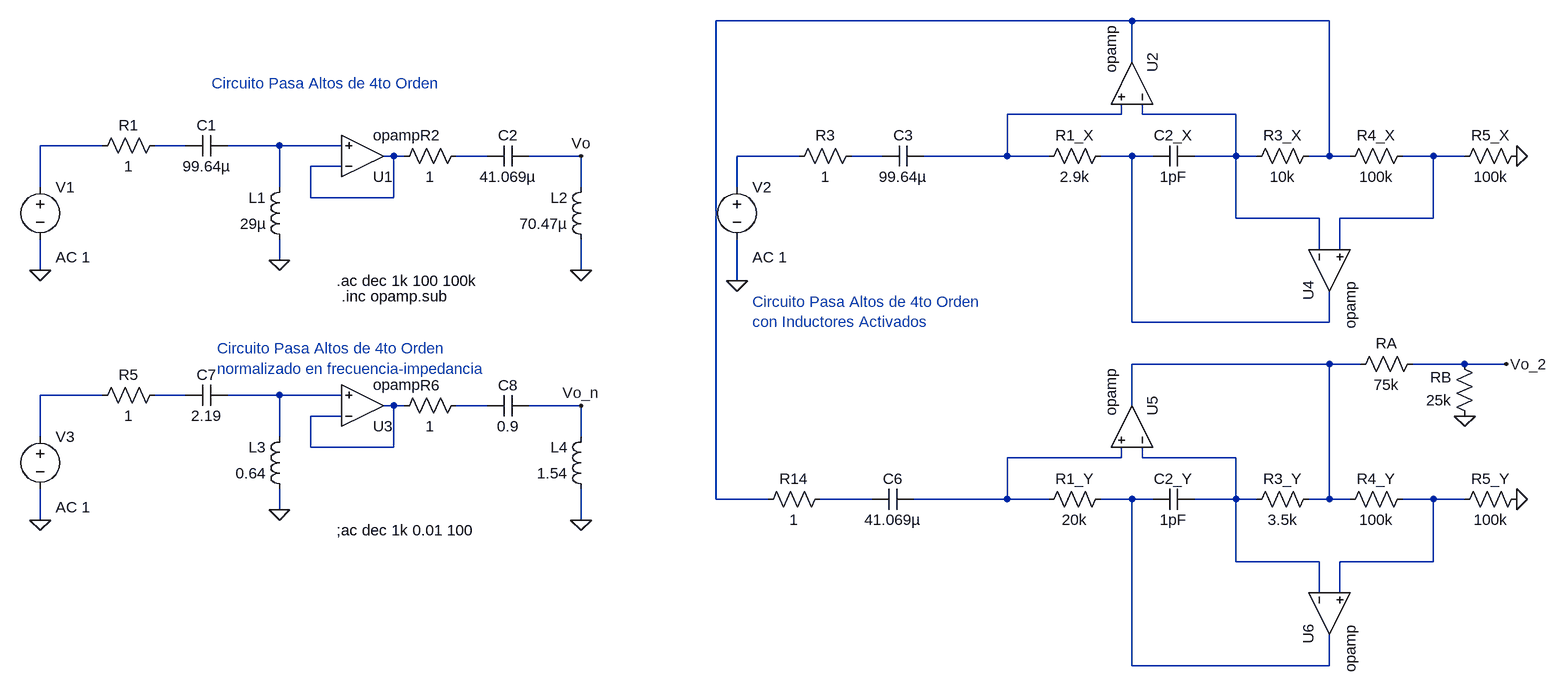
[diagram p0: schematic TS3.asc]
TS3.asc, the LTspice schematic file:
Version 4
SHEET 1 3096 884
WIRE 1552 -112 912 -112
WIRE 1856 -112 1552 -112
WIRE 1552 -48 1552 -112
WIRE 1536 32 1536 16
WIRE 1536 32 1360 32
WIRE 1568 32 1568 16
WIRE 1712 32 1568 32
WIRE -32 80 -128 80
WIRE 96 80 48 80
WIRE 240 80 160 80
WIRE 336 80 240 80
WIRE 416 96 400 96
WIRE 432 96 416 96
WIRE 560 96 512 96
WIRE 704 96 624 96
WIRE 1040 96 944 96
WIRE 1168 96 1120 96
WIRE 1360 96 1360 32
WIRE 1360 96 1232 96
WIRE 1424 96 1360 96
WIRE 1552 96 1504 96
WIRE 1584 96 1552 96
WIRE 1712 96 1712 32
WIRE 1712 96 1648 96
WIRE 1744 96 1712 96
WIRE 1856 96 1856 -112
WIRE 1856 96 1824 96
WIRE 1888 96 1856 96
WIRE 2016 96 1968 96
WIRE 2064 96 2016 96
WIRE 336 112 288 112
WIRE -128 144 -128 80
WIRE 240 144 240 80
WIRE 704 144 704 96
WIRE 944 144 944 96
WIRE 288 160 288 112
WIRE 416 160 416 96
WIRE 416 160 288 160
WIRE 1712 192 1712 96
WIRE 1840 192 1712 192
WIRE 2016 192 2016 96
WIRE 2016 192 1872 192
WIRE 1840 240 1840 192
WIRE 1872 240 1872 192
WIRE 240 256 240 224
WIRE -128 272 -128 224
WIRE 704 272 704 224
WIRE 944 288 944 224
WIRE 1552 352 1552 96
WIRE 1856 352 1856 304
WIRE 1856 352 1552 352
WIRE 1856 416 1552 416
WIRE 1904 416 1856 416
WIRE 2064 416 1984 416
WIRE 2128 416 2064 416
WIRE -32 464 -128 464
WIRE 96 464 48 464
WIRE 240 464 160 464
WIRE 336 464 240 464
WIRE 416 480 400 480
WIRE 432 480 416 480
WIRE 560 480 512 480
WIRE 704 480 624 480
WIRE 1552 480 1552 416
WIRE 336 496 288 496
WIRE -128 528 -128 464
WIRE 240 528 240 464
WIRE 704 528 704 480
WIRE 288 544 288 496
WIRE 416 544 416 480
WIRE 416 544 288 544
WIRE 1536 560 1536 544
WIRE 1536 560 1360 560
WIRE 1568 560 1568 544
WIRE 1712 560 1568 560
WIRE 912 624 912 -112
WIRE 992 624 912 624
WIRE 1152 624 1072 624
WIRE 1360 624 1360 560
WIRE 1360 624 1216 624
WIRE 1424 624 1360 624
WIRE 1552 624 1504 624
WIRE 1584 624 1552 624
WIRE 1712 624 1712 560
WIRE 1712 624 1648 624
WIRE 1744 624 1712 624
WIRE 1856 624 1856 416
WIRE 1856 624 1824 624
WIRE 1888 624 1856 624
WIRE 2016 624 1968 624
WIRE 2064 624 2016 624
WIRE 240 640 240 608
WIRE -128 656 -128 608
WIRE 704 656 704 608
WIRE 1712 720 1712 624
WIRE 1840 720 1712 720
WIRE 2016 720 2016 624
WIRE 2016 720 1872 720
WIRE 1840 768 1840 720
WIRE 1872 768 1872 720
WIRE 1552 880 1552 624
WIRE 1856 880 1856 832
WIRE 1856 880 1552 880
FLAG 240 256 0
FLAG 704 272 0
FLAG -128 272 0
FLAG 240 640 0
FLAG 704 656 0
FLAG -128 656 0
FLAG 704 96 Vo
FLAG 704 480 Vo_n
FLAG 944 288 0
FLAG 2144 96 0
FLAG 2144 624 0
FLAG 2064 496 0
FLAG 2128 416 Vo_2
SYMBOL res 64 64 R90
WINDOW 0 0 56 VBottom 2
WINDOW 3 32 56 VTop 2
SYMATTR InstName R1
SYMATTR Value 1
SYMBOL ind 256 240 R180
WINDOW 0 36 80 Left 2
WINDOW 3 36 40 Left 2
SYMATTR InstName L1
SYMATTR Value 29µ
SYMBOL cap 160 64 R90
WINDOW 0 0 32 VBottom 2
WINDOW 3 32 32 VTop 2
SYMATTR InstName C1
SYMATTR Value 99.64µ
SYMBOL OpAmps\\opamp 368 160 M180
SYMATTR InstName U1
SYMBOL res 528 80 R90
WINDOW 0 0 56 VBottom 2
WINDOW 3 32 56 VTop 2
SYMATTR InstName R2
SYMATTR Value 1
SYMBOL ind 720 240 R180
WINDOW 0 36 80 Left 2
WINDOW 3 36 40 Left 2
SYMATTR InstName L2
SYMATTR Value 70.47µ
SYMBOL cap 624 80 R90
WINDOW 0 0 32 VBottom 2
WINDOW 3 32 32 VTop 2
SYMATTR InstName C2
SYMATTR Value 41.069µ
SYMBOL voltage -128 128 R0
WINDOW 123 24 124 Left 2
WINDOW 39 0 0 Left 0
SYMATTR Value2 AC 1
SYMATTR InstName V1
SYMATTR Value ""
SYMBOL res 64 448 R90
WINDOW 0 0 56 VBottom 2
WINDOW 3 32 56 VTop 2
SYMATTR InstName R5
SYMATTR Value 1
SYMBOL ind 256 624 R180
WINDOW 0 36 80 Left 2
WINDOW 3 36 40 Left 2
SYMATTR InstName L3
SYMATTR Value 0.64
SYMBOL cap 160 448 R90
WINDOW 0 0 32 VBottom 2
WINDOW 3 32 32 VTop 2
SYMATTR InstName C7
SYMATTR Value 2.19
SYMBOL OpAmps\\opamp 368 544 M180
SYMATTR InstName U3
SYMBOL res 528 464 R90
WINDOW 0 0 56 VBottom 2
WINDOW 3 32 56 VTop 2
SYMATTR InstName R6
SYMATTR Value 1
SYMBOL ind 720 624 R180
WINDOW 0 36 80 Left 2
WINDOW 3 36 40 Left 2
SYMATTR InstName L4
SYMATTR Value 1.54
SYMBOL cap 624 464 R90
WINDOW 0 0 32 VBottom 2
WINDOW 3 32 32 VTop 2
SYMATTR InstName C8
SYMATTR Value 0.9
SYMBOL voltage -128 512 R0
WINDOW 123 24 124 Left 2
WINDOW 39 0 0 Left 0
SYMATTR Value2 AC 1
SYMATTR InstName V3
SYMATTR Value ""
SYMBOL res 1136 80 R90
WINDOW 0 0 56 VBottom 2
WINDOW 3 32 56 VTop 2
SYMATTR InstName R3
SYMATTR Value 1
SYMBOL cap 1232 80 R90
WINDOW 0 0 32 VBottom 2
WINDOW 3 32 32 VTop 2
SYMATTR InstName C3
SYMATTR Value 99.64µ
SYMBOL res 1520 80 R90
WINDOW 0 0 56 VBottom 2
WINDOW 3 32 56 VTop 2
SYMATTR InstName R1_X
SYMATTR Value 2.9k
SYMBOL cap 1648 80 R90
WINDOW 0 0 32 VBottom 2
WINDOW 3 32 32 VTop 2
SYMATTR InstName C2_X
SYMATTR Value 1pF
SYMBOL OpAmps\\opamp 1616 -16 M270
SYMATTR InstName U2
SYMATTR SpiceLine Aol=100000K
SYMATTR SpiceLine2 GBW=10000Meg
SYMBOL res 1840 80 R90
WINDOW 0 0 56 VBottom 2
WINDOW 3 32 56 VTop 2
SYMATTR InstName R3_X
SYMATTR Value 10k
SYMBOL res 1984 80 R90
WINDOW 0 0 56 VBottom 2
WINDOW 3 32 56 VTop 2
SYMATTR InstName R4_X
SYMATTR Value 100k
SYMBOL res 2160 80 R90
WINDOW 0 0 56 VBottom 2
WINDOW 3 32 56 VTop 2
SYMATTR InstName R5_X
SYMATTR Value 100k
SYMBOL OpAmps\\opamp 1792 272 M90
SYMATTR InstName U4
SYMATTR SpiceLine Aol=100000K
SYMATTR SpiceLine2 GBW=10000Meg
SYMBOL res 1520 608 R90
WINDOW 0 0 56 VBottom 2
WINDOW 3 32 56 VTop 2
SYMATTR InstName R1_Y
SYMATTR Value 20k
SYMBOL cap 1648 608 R90
WINDOW 0 0 32 VBottom 2
WINDOW 3 32 32 VTop 2
SYMATTR InstName C2_Y
SYMATTR Value 1pF
SYMBOL OpAmps\\opamp 1616 512 M270
SYMATTR InstName U5
SYMATTR SpiceLine Aol=100000K
SYMATTR SpiceLine2 GBW=10000Meg
SYMBOL res 1840 608 R90
WINDOW 0 0 56 VBottom 2
WINDOW 3 32 56 VTop 2
SYMATTR InstName R3_Y
SYMATTR Value 3.5k
SYMBOL res 1984 608 R90
WINDOW 0 0 56 VBottom 2
WINDOW 3 32 56 VTop 2
SYMATTR InstName R4_Y
SYMATTR Value 100k
SYMBOL res 2160 608 R90
WINDOW 0 0 56 VBottom 2
WINDOW 3 32 56 VTop 2
SYMATTR InstName R5_Y
SYMATTR Value 100k
SYMBOL OpAmps\\opamp 1792 800 M90
SYMATTR InstName U6
SYMATTR SpiceLine Aol=100000K
SYMATTR SpiceLine2 GBW=10000Meg
SYMBOL res 1088 608 R90
WINDOW 0 0 56 VBottom 2
WINDOW 3 32 56 VTop 2
SYMATTR InstName R14
SYMATTR Value 1
SYMBOL cap 1216 608 R90
WINDOW 0 0 32 VBottom 2
WINDOW 3 32 32 VTop 2
SYMATTR InstName C6
SYMATTR Value 41.069µ
SYMBOL voltage 944 128 R0
WINDOW 123 24 124 Left 2
WINDOW 39 0 0 Left 0
SYMATTR Value2 AC 1
SYMATTR InstName V2
SYMATTR Value ""
SYMBOL res 2000 400 R90
WINDOW 0 0 56 VBottom 2
WINDOW 3 32 56 VTop 2
SYMATTR InstName RA
SYMATTR Value 75k
SYMBOL res 2080 512 R180
WINDOW 0 36 76 Left 2
WINDOW 3 36 40 Left 2
SYMATTR InstName RB
SYMATTR Value 25k
TEXT 328 288 Left 2 !.ac dec 1k 100 100k
TEXT 336 312 Left 2 !.inc opamp.sub
TEXT 328 672 Left 2 !;ac dec 1k 0.01 100
TEXT 136 -16 Left 2 ;Circuito Pasa Altos de 4to Orden
TEXT 968 320 Left 2 ;Circuito Pasa Altos de 4to Orden\ncon Inductores Activados
TEXT 144 392 Left 2 ;Circuito Pasa Altos de 4to Orden\nnormalizado en frecuencia-impedancia

The netlist it stands for:
* TS3.asc
R1 N005 N004 1
L1 0 N006 29µ
C1 N006 N005 99.64µ
XU1 N007 N006 N007 opamp Aol=100K GBW=10Meg  ; pins invin noninvin out
R2 N008 N007 1
L2 0 Vo 70.47µ
C2 Vo N008 41.069µ
V1 N004 0 AC 1
R5 N015 N014 1
L3 0 N016 0.64
C7 N016 N015 2.19
XU3 N017 N016 N017 opamp Aol=100K GBW=10Meg  ; pins invin noninvin out
R6 N018 N017 1
L4 0 Vo_n 1.54
C8 Vo_n N018 0.9
V3 N014 0 AC 1
R3 N010 N009 1
C3 N002 N010 99.64µ
R1_X N011 N002 2.9k
C2_X N003 N011 1pF
XU2 N003 N002 N001 opamp Aol=100000K GBW=10000Meg  ; pins invin noninvin out
R3_X N001 N003 10k
R4_X N012 N001 100k
R5_X 0 N012 100k
XU4 N003 N012 N011 opamp Aol=100000K GBW=10000Meg  ; pins invin noninvin out
R1_Y N022 N019 20k
C2_Y N020 N022 1pF
XU5 N020 N019 N013 opamp Aol=100000K GBW=10000Meg  ; pins invin noninvin out
R3_Y N013 N020 3.5k
R4_Y N023 N013 100k
R5_Y 0 N023 100k
XU6 N020 N023 N022 opamp Aol=100000K GBW=10000Meg  ; pins invin noninvin out
R14 N021 N001 1
C6 N019 N021 41.069µ
V2 N009 0 AC 1
RA Vo_2 N013 75k
RB 0 Vo_2 25k
.ac dec 1k 100 100k
.inc opamp.sub
;ac dec 1k 0.01 100
* Circuito Pasa Altos de 4to Orden
* Circuito Pasa Altos de 4to Orden
* con Inductores Activados
* Circuito Pasa Altos de 4to Orden
* normalizado en frecuencia-impedancia
.backanno
.end